# EAGLE design heart (EAGLE 7.6.0)
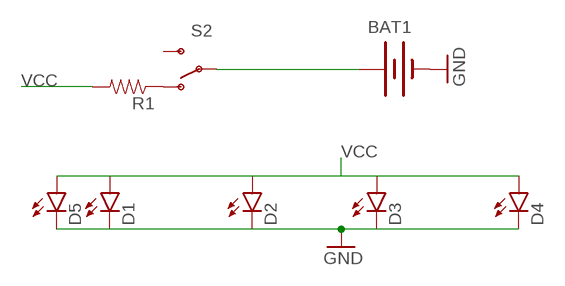
[diagram p0: schematic, sheet 1]

## Parts
BAT1  BATTERY12MM  [BATTCON_12MM]
D1  LED0603  [LED-0603]
D2  LED0603  [LED-0603]
D3  LED0603  [LED-0603]
D4  LED0603  [LED-0603]
D5  LED0603  [LED-0603]
R1  RESISTOR0603  [0603-RES]
S2  SWITCH-SPDTSMD_NOHOLE  [AYZ0202_NOHOLE]

## Nets
GND: BAT1.GND(-) D1.C D2.C D3.C D4.C D5.C
N$2: BAT1.PWR@1(+) S2.2(P)
N$4: R1.1 S2.1(O)
VCC: D1.A D2.A D3.A D4.A D5.A R1.2
Unconnected: S2.3(S)

## Library data of the parts
BAT1 = SparkFun-Electromechanical:BATTERY: Battery Holders Various common sizes : AA, AAA, 18650 (PRT-12895), 20mm coin cell and 12mm coin cell. 20MM_4LEGS, BATT-10373; PROD_ID: BATT-08044
D1-D5 = SparkFun-LED:LED: LEDs Standard schematic elements and footprints for 5mm, 3mm, 1206, and 0603 sized LEDs. 5mm - Spark Fun Electronics SKU : COM-00529 (and others)
R1 = SparkFun-Resistors:RESISTOR: Resistor Basic schematic elements and footprints for 0603, 1206, and PTH resistors.
S2 = SparkFun-Electromechanical:SWITCH-SPDT: SPDT Switch Simple slide switch, Spark Fun Electronics SKU : COM-00102 DPDT SMT slide switch, AYZ0202, SWCH-08179

## Board
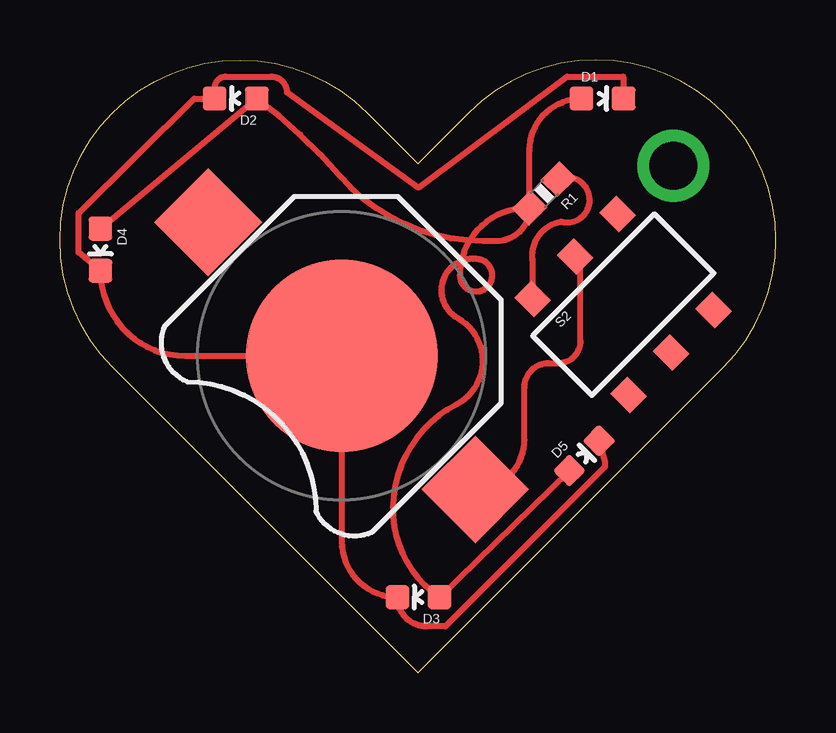
[diagram p1: board, top side]
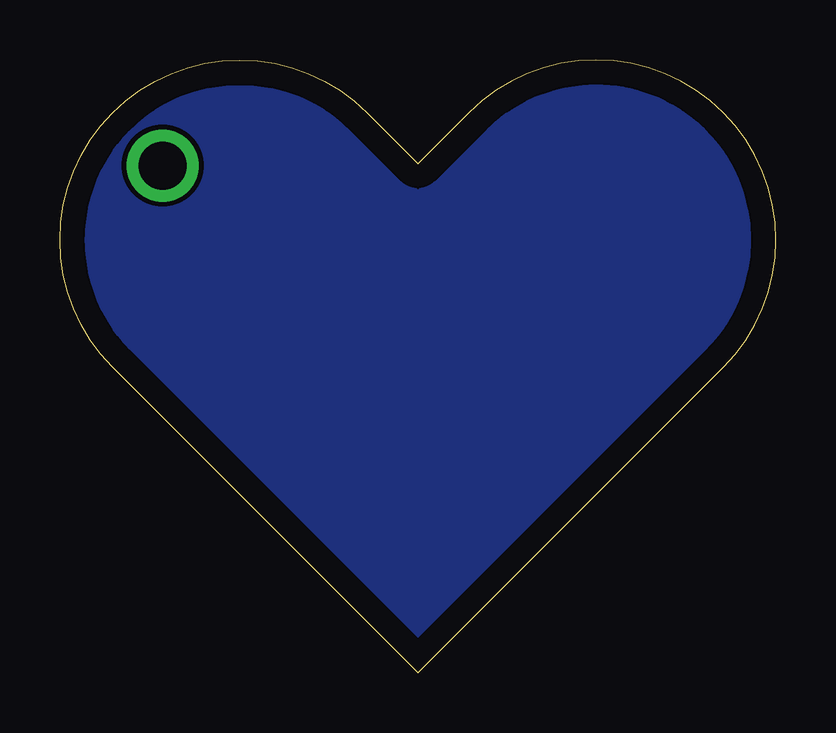
[diagram p2: board, bottom side, seen from below]

Size 29.85 x 25.53 mm. Coordinates in mm from the lower left corner, seen from the top.
Outline: 14.92,0 2.2,12.73 arc-180 12.8,23.33 14.92,21.21 17.05,23.33 arc-180 27.65,12.73 14.92,0
Copper layers (1*16): Top 0.035mm / dielectric 1.5mm / Bottom 0.035mm
Design rules "default *": minimum track width 10mil, minimum drill 24mil, track to track 8mil, track to pad 8mil, pad to pad 8mil, via to via 8mil, smd to smd 8mil, copper to edge 40mil, drill to drill 8mil, minimum pad ring 10mil, minimum via ring 8mil, stop-mask expansion 4mil, vias tented up to drill 30mil, thermal gap 10mil

### Footprints (pad centres in the part's own frame; a part is rotated, then mirrored left to right if it is on the bottom)
BATTCON_12MM = smd 8 x 8: GND 0,0 | smd 3.175 x 3.175: PWR@1 -7.874,0; PWR@2 7.874,0
LED-0603 = smd 1 x 1: A 0,-0.877; C 0,0.877
0603-RES = smd 1.1 x 1: 1 -0.85,0; 2 0.85,0
AYZ0202_NOHOLE = smd 1 x 1.15: 1 -2.5,2.825; 2 0,2.825; 3 2.5,2.825; 4 -2.5,-2.825; 5 0,-2.825; 6 2.5,-2.825

### Placement (x,y rotation side)
BAT1  11.75,13.21 135 top
D1  22.62,23.93 270 top
D2  7.33,23.93 90 top
D3  14.95,3.15 90 top
D4  1.69,17.63 180 top
D5  21.86,9.04 315 top
R1  20.18,19.96 225 top
S2  23.48,15.34 45 top

### Tracks (layer width: path | path; a pad name or v marks a point on that pad's centre or on a via)
GND
  Top 0.254: D1.C arc-90 D1.C 23.48,24.84 21.14,24.84 14.95,20.22 9.46,24.18 arc90 8.8,24.84 6.92,24.84 arc90 6.45,24.37 D2.C 5.6,23.93 0.77,19.15 0.77,17.51 D4.C arc90 5.23,13.21 BAT1.GND 11.75,5.47 arc90 D3.C arc90 15.29,1.93 16.06,1.93 22.72,8.59 22.72,8.79 D5.C
N$1
  pour Bottom: 14.9,1.17 1.89,14.22 arc-173 12.92,22.1 14.92,20.12 18.55,23.52 arc-171 27.04,13.31
N$2
  Top 0.254: BAT1.PWR@1 arc90 19.37,9.69 19.37,11.89 arc-90 20.38,12.9 20.79,12.9 arc90 21.7,13.82 21.7,17.12 arc90 S2.2
N$3  (via drill 2)
  other vias: 25.56,21.13
N$4
  Top 0.254: S2.1 19.72,17.11 arc-90 20.89,18.8 arc219 R1.1
VCC
  Top 0.254: D4.A D2.A arc-13 11.65,20.73 arc49 17.64,17.98 18.2,17.98 arc90 R1.2 | R1.2 19.58,21.76 arc-90 D1.A | R1.2 19.48,19.36 arc90 16.67,16.56 arc258 17.49,17.22 arc163 16.57,14.78 arc-123 16.52,11.18 arc61 13.88,6.91 arc57 D3.A D5.A